# Altium schematic sheet EEG_Schematic.SchDoc: Low-Cost EEG
size A2; DrawnBy: Xavier Asghar; Revision: 1.0; SheetNumber: 1; SheetTotal: 1
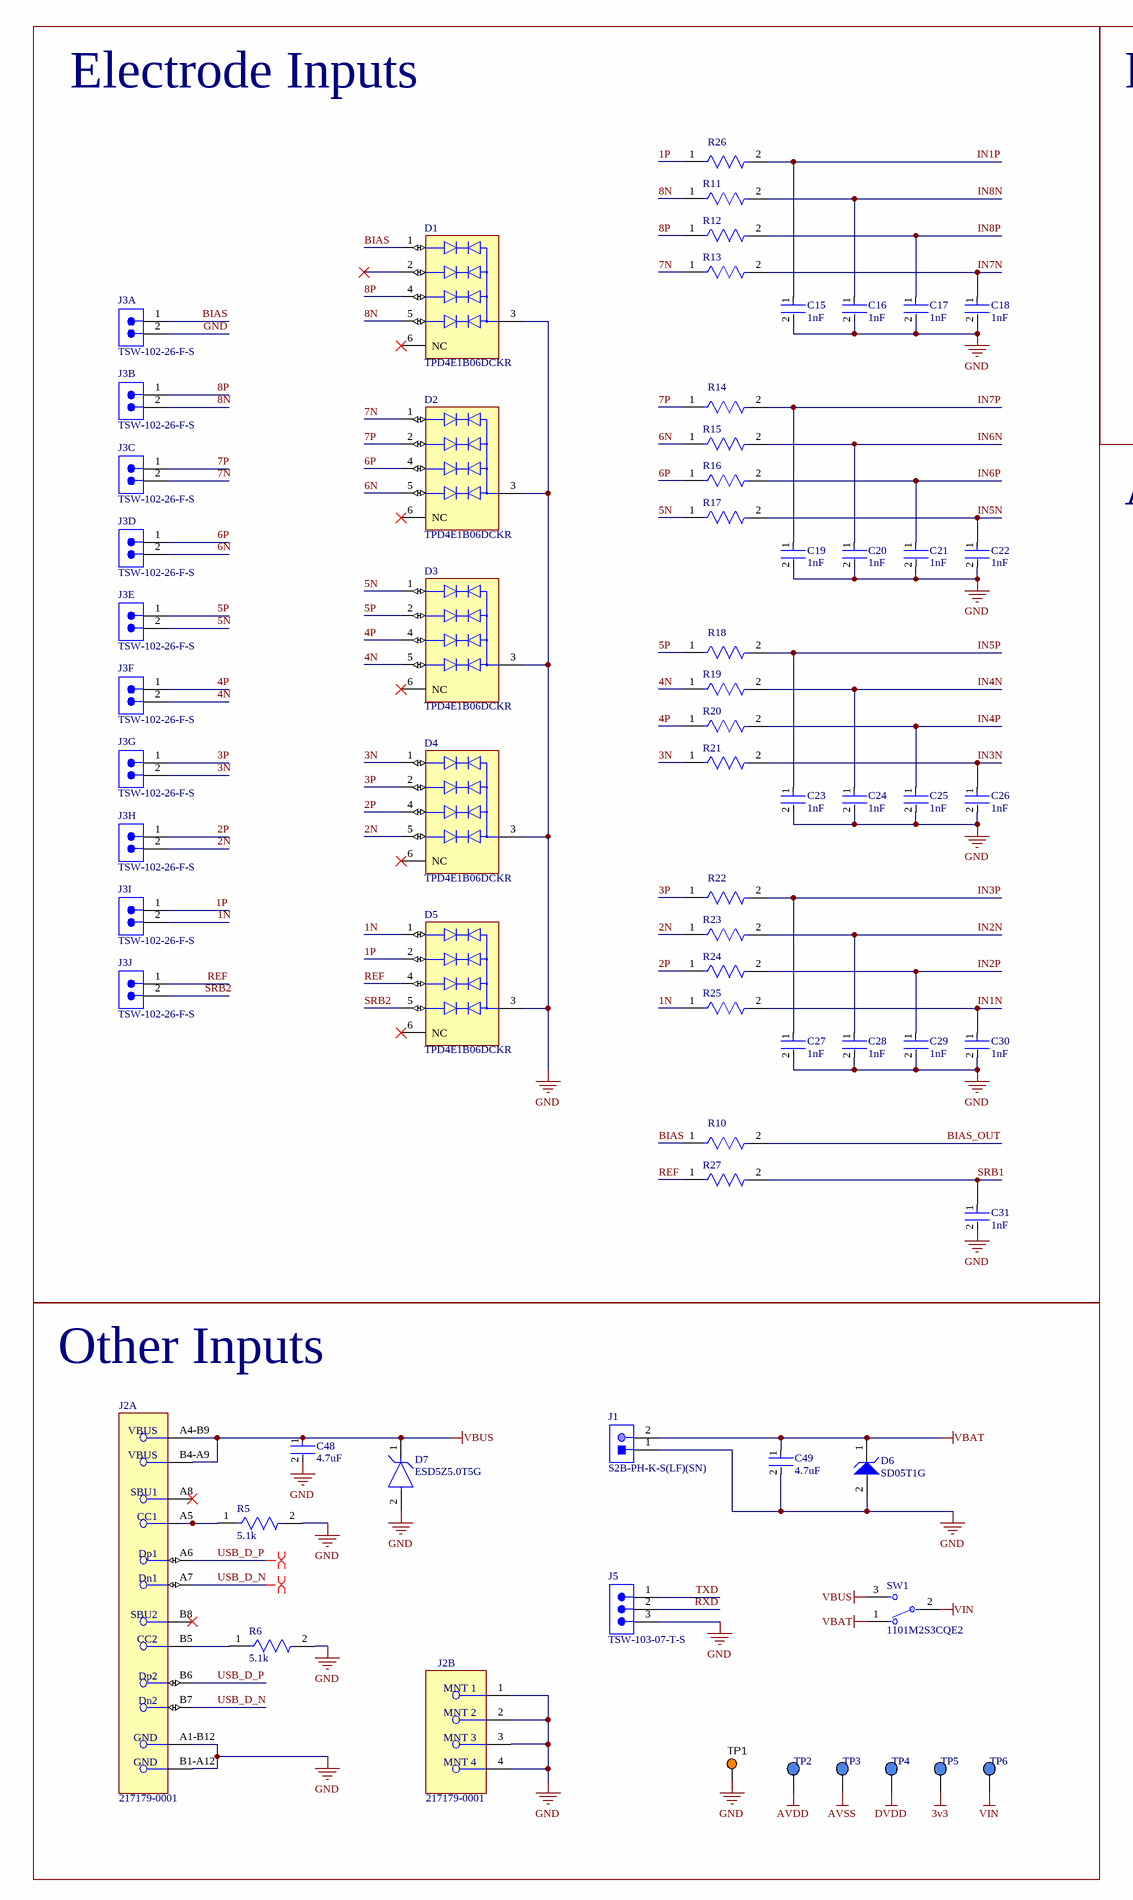
[diagram p0: EEG_Schematic.SchDoc, left]
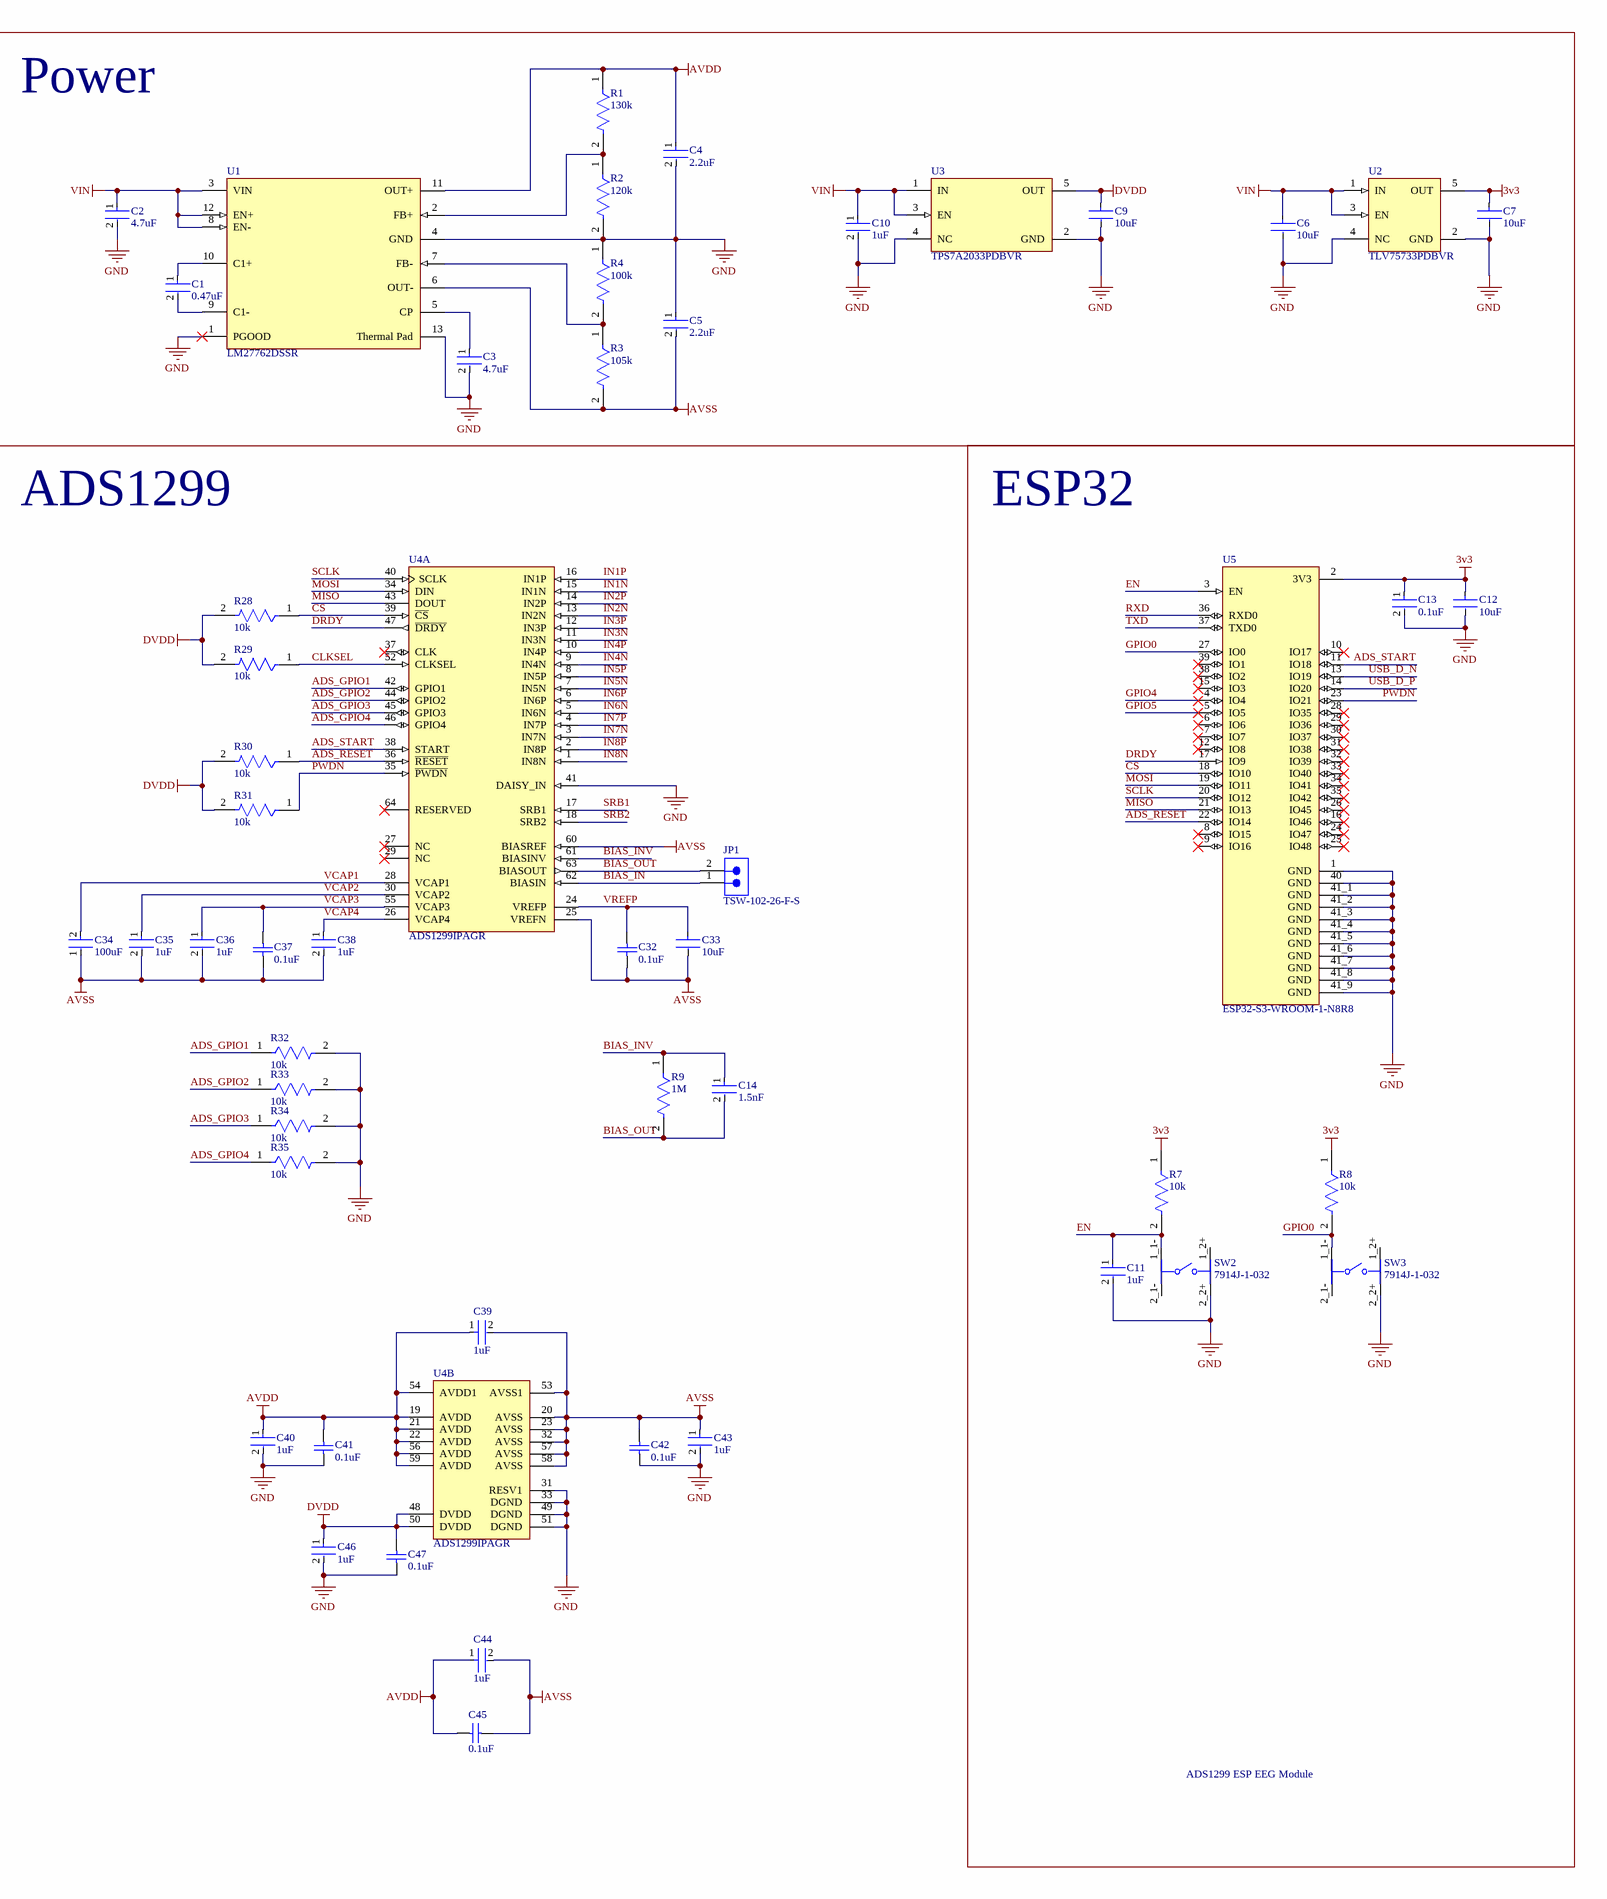
[diagram p1: EEG_Schematic.SchDoc, right]

## Parts
C1  0.47uF  [FP-C0603C-CF-MFG]
C2  4.7uF  [FP-GCJ21B-0_3-IPC_A]
C3  4.7uF  [FP-GCJ21B-0_3-IPC_A]
C4  2.2uF  [FP-GCM21B-0_15-IPC_B]
C5  2.2uF  [FP-GCM21B-0_15-IPC_B]
C6  10uF  [FP-GRJ21B-0_3-0_2-MFG]
C7  10uF  [FP-GRJ21B-0_3-0_2-MFG]
C9  10uF  [FP-GRJ21B-0_3-0_2-MFG]
C10  1uF  [FP-CC0603-DA-MFG]
C11  1uF  [FP-CC0603-DA-MFG]
C12  10uF  [FP-GRJ21B-0_3-0_2-MFG]
C13  0.1uF  [FP-CGA3E-0_3-0_1-MFG]
C14  1.5nF  [FP-C0603C-CF-MFG]
C15  1nF  [FP-C0603C-CF-MFG]
C16  1nF  [FP-C0603C-CF-MFG]
C17  1nF  [FP-C0603C-CF-MFG]
C18  1nF  [FP-C0603C-CF-MFG]
C19  1nF  [FP-C0603C-CF-MFG]
C20  1nF  [FP-C0603C-CF-MFG]
C21  1nF  [FP-C0603C-CF-MFG]
C22  1nF  [FP-C0603C-CF-MFG]
C23  1nF  [FP-C0603C-CF-MFG]
C24  1nF  [FP-C0603C-CF-MFG]
C25  1nF  [FP-C0603C-CF-MFG]
C26  1nF  [FP-C0603C-CF-MFG]
C27  1nF  [FP-C0603C-CF-MFG]
C28  1nF  [FP-C0603C-CF-MFG]
C29  1nF  [FP-C0603C-CF-MFG]
C30  1nF  [FP-C0603C-CF-MFG]
C31  1nF  [FP-C0603C-CF-MFG]
C32  0.1uF  [CAPC1608X87X45LL20T05]
C33  10uF  [FP-GRJ21B-0_3-0_2-MFG]
C34  100uF  [FP-GRM31C-0_3-e0_3_0_8-IPC_B]
C35  1uF  [FP-CC0603-DA-MFG]
C36  1uF  [FP-CC0603-DA-MFG]
C37  0.1uF  [CAPC1608X87X45LL20T05]
C38  1uF  [FP-CC0603-DA-MFG]
C39  1uF  [FP-CC0603-DA-MFG]
C40  1uF  [FP-CC0603-DA-MFG]
C41  0.1uF  [CAPC1608X87X45LL20T05]
C42  0.1uF  [CAPC1608X87X45LL20T05]
C43  1uF  [FP-CC0603-DA-MFG]
C44  1uF  [FP-CC0603-DA-MFG]
C45  0.1uF  [CAPC1608X87X45LL20T05]
C46  1uF  [FP-CC0603-DA-MFG]
C47  0.1uF  [CAPC1608X87X45LL20T05]
C48  4.7uF  [FP-GCJ21B-0_3-IPC_A]
C49  4.7uF  [FP-GCJ21B-0_3-IPC_A]
D1  TPD4E1B06DCKR  [TVS_TPD4E1B06DCKR]
D2  TPD4E1B06DCKR  [TVS_TPD4E1B06DCKR]
D3  TPD4E1B06DCKR  [TVS_TPD4E1B06DCKR]
D4  TPD4E1B06DCKR  [TVS_TPD4E1B06DCKR]
D5  TPD4E1B06DCKR  [TVS_TPD4E1B06DCKR]
D6  SD05T1G  [ONSC-SOD-323-2-477-02_G_V]
D7  ESD5Z5.0T5G  [FP-502-01-MFG]
J1  S2B-PH-K-S(LF)(SN)  [JST-S2B-PH-K-S_V]
J2  217179-0001  [FP-2171790001-MFG]  (parts A,B of 2)
J3A  TSW-102-26-F-S  [SMTC-TSW-102-26-XX-S]
J3B  TSW-102-26-F-S  [SMTC-TSW-102-26-XX-S]
J3C  TSW-102-26-F-S  [SMTC-TSW-102-26-XX-S]
J3D  TSW-102-26-F-S  [SMTC-TSW-102-26-XX-S]
J3E  TSW-102-26-F-S  [SMTC-TSW-102-26-XX-S]
J3F  TSW-102-26-F-S  [SMTC-TSW-102-26-XX-S]
J3G  TSW-102-26-F-S  [SMTC-TSW-102-26-XX-S]
J3H  TSW-102-26-F-S  [SMTC-TSW-102-26-XX-S]
J3I  TSW-102-26-F-S  [SMTC-TSW-102-26-XX-S]
J3J  TSW-102-26-F-S  [SMTC-TSW-102-26-XX-S]
J5  TSW-103-07-T-S  [SMTC-TSW-103-07-X-S]
JP1  TSW-102-26-F-S  [SMTC-TSW-102-26-XX-S]
R1  130k  [FP-MCT0603-IPC_B]
R2  120k  [FP-RT0603-MFG]
R3  105k  [FP-RT0603-MFG]
R4  100k  [FP-AT0603-IPC_A]
R5  5.1k  [FP-RT0603-MFG]
R6  5.1k  [FP-RT0603-MFG]
R7  10k  [FP-AC0603-MFG]
R8  10k  [FP-AC0603-MFG]
R9  1M  [FP-MCT0603-MFG]
R10  2.2k  [FP-MCT0603-IPC_A]  (value not drawn)
R11  2.2k  [FP-MCT0603-IPC_A]  (value not drawn)
R12  2.2k  [FP-MCT0603-IPC_A]  (value not drawn)
R13  2.2k  [FP-MCT0603-IPC_A]  (value not drawn)
R14  2.2k  [FP-MCT0603-IPC_A]  (value not drawn)
R15  2.2k  [FP-MCT0603-IPC_A]  (value not drawn)
R16  2.2k  [FP-MCT0603-IPC_A]  (value not drawn)
R17  2.2k  [FP-MCT0603-IPC_A]  (value not drawn)
R18  2.2k  [FP-MCT0603-IPC_A]  (value not drawn)
R19  2.2k  [FP-MCT0603-IPC_A]  (value not drawn)
R20  2.2k  [FP-MCT0603-IPC_A]  (value not drawn)
R21  2.2k  [FP-MCT0603-IPC_A]  (value not drawn)
R22  2.2k  [FP-MCT0603-IPC_A]  (value not drawn)
R23  2.2k  [FP-MCT0603-IPC_A]  (value not drawn)
R24  2.2k  [FP-MCT0603-IPC_A]  (value not drawn)
R25  2.2k  [FP-MCT0603-IPC_A]  (value not drawn)
R26  2.2k  [FP-MCT0603-IPC_A]  (value not drawn)
R27  2.2k  [FP-MCT0603-IPC_A]  (value not drawn)
R28  10k  [FP-AC0603-MFG]
R29  10k  [FP-AC0603-MFG]
R30  10k  [FP-AC0603-MFG]
R31  10k  [FP-AC0603-MFG]
R32  10k  [FP-AC0603-MFG]
R33  10k  [FP-AC0603-MFG]
R34  10k  [FP-AC0603-MFG]
R35  10k  [FP-AC0603-MFG]
SW1  1101M2S3CQE2  [FP-1101M2S3CQE2-MFG]
SW2  7914J-1-032  [FP-7914J-1-032-MFG]
SW3  7914J-1-032  [FP-7914J-1-032-MFG]
TP1  (no value)  [KSTN-5003]
TP2  TP  [TP_SMD_2mm]  (value not drawn)
TP3  TP  [TP_SMD_2mm]  (value not drawn)
TP4  TP  [TP_SMD_2mm]  (value not drawn)
TP5  TP  [TP_SMD_2mm]  (value not drawn)
TP6  TP  [TP_SMD_2mm]  (value not drawn)
U1  LM27762DSSR  [FP-DSS0012B-MFG]
U2  TLV75733PDBVR  [FP-DBV0005A-MFG]
U3  TPS7A2033PDBVR  [FP-DBV0005A-MFG]
U4  ADS1299IPAGR  [PAG0064A_M]  (parts A,B of 2)
U5  ESP32-S3-WROOM-1-N8R8  [XCVR_ESP32S3WROOM1N8R8]

## Blocks framed on the sheet
Electrode Inputs: C15-C31 D1-D5 J3A J3B J3C J3D J3E J3F J3G J3H J3I J3J R10-R27
Power: C1-C7 C9 C10 R1-R4 U1-U3
ESP32: C11-C13 R7 R8 SW2 SW3 U5
Other Inputs: C48 C49 D6 D7 J1 J2 J5 R5 R6 SW1 TP1-TP6

## Nets
3v3: C7.1 C12.1 C13.1 R7.1 R8.1 TP5.1(TP) U2.5(OUT) U5.2(3V3)
AVDD: C4.1 C39.1 C40.1 C41.2 C44.1 C45.2 R1.1 TP2.1(TP) U1.11(OUT+) U4.19(AVDD) U4.21(AVDD) U4.22(AVDD) U4.54(AVDD1) U4.56(AVDD) U4.59(AVDD)
AVSS: C5.2 C32.1 C33.2 C34.1 C35.2 C36.2 C37.1 C38.2 C39.2 C42.2 C43.1 C44.2 C45.1 R3.2 TP3.1(TP) U1.6(OUT-) U4.20(AVSS) U4.23(AVSS) U4.25(VREFN) U4.32(AVSS) U4.53(AVSS1) U4.57(AVSS) U4.58(AVSS) U4.60(BIASREF)
DVDD: C9.1 C46.1 C47.2 R28.2 R29.2 R30.2 R31.2 TP4.1(TP) U3.5(OUT) U4.48(DVDD) U4.50(DVDD)
GND: C2.2 C3.2 C4.2 C5.1 C6.2 C7.2 C9.2 C10.2 C11.2 C12.2 C13.2 C15.2 C16.2 C17.2 C18.2 C19.2 C20.2 C21.2 C22.2 C23.2 C24.2 C25.2 C26.2 C27.2 C28.2 C29.2 C30.2 C31.2 C40.2 C41.1 C42.1 C43.2 C46.2 C47.1 C48.2 C49.2 D1.3(GND) D2.3(GND) D3.3(GND) D4.3(GND) D5.3(GND) D6.2(A) D7.2(A) J1.1 J2.1(MNT_1) J2.2(MNT_2) J2.3(MNT_3) J2.4(MNT_4) J2.A1-B12(GND) J2.B1-A12(GND) J3A.2 J5.3 R2.2 R4.1 R5.2 R6.2 R32.2 R33.2 R34.2 R35.2 SW2.2_2+(2_2+) SW3.2_2+(2_2+) TP1.1 U1.1(PGOOD) U1.4(GND) U1.13(Thermal_Pad) U2.2(GND) U2.4(NC) U3.2(GND) U3.4(NC) U4.31(RESV1) U4.33(DGND) U4.41(DAISY_IN) U4.49(DGND) U4.51(DGND) U5.1(GND) U5.40(GND) U5.41_1(GND) U5.41_2(GND) U5.41_3(GND) U5.41_4(GND) U5.41_5(GND) U5.41_6(GND) U5.41_7(GND) U5.41_8(GND) U5.41_9(GND)
VBAT: C49.1 D6.1(K) J1.2 SW1.1
VBUS: C48.1 D7.1(C) J2.A4-B9(VBUS) J2.B4-A9(VBUS) SW1.3
VIN: C2.1 C6.1 C10.1 SW1.2(COMM) TP6.1(TP) U1.3(VIN) U1.8(EN-) U1.12(EN+) U2.1(IN) U2.3(EN) U3.1(IN) U3.3(EN)
1N: D5.1(IO1) J3I.2 R25.1
1P: D5.2(IO2) J3I.1 R26.1
2N: D4.5(IO4) J3H.2 R23.1
2P: D4.4(IO3) J3H.1 R24.1
3N: D4.1(IO1) J3G.2 R21.1
3P: D4.2(IO2) J3G.1 R22.1
4N: D3.5(IO4) J3F.2 R19.1
4P: D3.4(IO3) J3F.1 R20.1
5N: D3.1(IO1) J3E.2 R17.1
5P: D3.2(IO2) J3E.1 R18.1
6N: D2.5(IO4) J3D.2 R15.1
6P: D2.4(IO3) J3D.1 R16.1
7N: D2.1(IO1) J3C.2 R13.1
7P: D2.2(IO2) J3C.1 R14.1
8N: D1.5(IO4) J3B.2 R11.1
8P: D1.4(IO3) J3B.1 R12.1
ADS_GPIO1: R32.1 U4.42(GPIO1)
ADS_GPIO2: R33.1 U4.44(GPIO2)
ADS_GPIO3: R34.1 U4.45(GPIO3)
ADS_GPIO4: R35.1 U4.46(GPIO4)
ADS_RESET: R30.1 U4.36(~{RESET}) U5.22(IO14)
ADS_START: U4.38(START) U5.11(IO18)
BIAS: D1.1(IO1) J3A.1 R10.1
BIAS_IN: JP1.1 U4.62(BIASIN)
BIAS_INV: C14.1 R9.1 U4.61(BIASINV)
BIAS_OUT: C14.2 JP1.2 R9.2 R10.2 U4.63(BIASOUT)
CLKSEL: R29.1 U4.52(CLKSEL)
CS: R28.1 U4.39(~{CS}) U5.18(IO10)
DRDY: U4.47(~{DRDY}) U5.17(IO9)
EN: C11.1 R7.2 SW2.1_1-(1_1-) U5.3(EN)
GPIO0: R8.2 SW3.1_1-(1_1-) U5.27(IO0)
GPIO4: U5.4(IO4)
GPIO5: U5.5(IO5)
IN1N: C30.1 R25.2 U4.15(IN1N)
IN1P: C15.1 R26.2 U4.16(IN1P)
IN2N: C28.1 R23.2 U4.13(IN2N)
IN2P: C29.1 R24.2 U4.14(IN2P)
IN3N: C26.1 R21.2 U4.11(IN3N)
IN3P: C27.1 R22.2 U4.12(IN3P)
IN4N: C24.1 R19.2 U4.9(IN4N)
IN4P: C25.1 R20.2 U4.10(IN4P)
IN5N: C22.1 R17.2 U4.7(IN5N)
IN5P: C23.1 R18.2 U4.8(IN5P)
IN6N: C20.1 R15.2 U4.5(IN6N)
IN6P: C21.1 R16.2 U4.6(IN6P)
IN7N: C18.1 R13.2 U4.3(IN7N)
IN7P: C19.1 R14.2 U4.4(IN7P)
IN8N: C16.1 R11.2 U4.1(IN8N)
IN8P: C17.1 R12.2 U4.2(IN8P)
MISO: U4.43(DOUT) U5.21(IO13)
MOSI: U4.34(DIN) U5.19(IO11)
PWDN: R31.1 U4.35(~{PWDN}) U5.23(IO21)
REF: D5.4(IO3) J3J.1 R27.1
RXD: J5.2 U5.36(RXD0)
SCLK: U4.40(SCLK) U5.20(IO12)
SRB1: C31.1 R27.2 U4.17(SRB1)
SRB2: D5.5(IO4) J3J.2 U4.18(SRB2)
TXD: J5.1 U5.37(TXD0)
USB_D_N: J2.A7(Dn1) J2.B7(Dn2) U5.13(IO19)
USB_D_P: J2.A6(Dp1) J2.B6(Dp2) U5.14(IO20)
VCAP1: C34.2 U4.28(VCAP1)
VCAP2: C35.1 U4.30(VCAP2)
VCAP3: C36.1 C37.2 U4.55(VCAP3)
VCAP4: C38.1 U4.26(VCAP4)
VREFP: C32.2 C33.1 U4.24(VREFP)
NetC1_1: C1.1 U1.10(C1+)
NetC1_2: C1.2 U1.9(C1-)
NetC3_1: C3.1 U1.5(CP)
NetJ2_A5: J2.A5(CC1) R5.1
NetJ2_B5: J2.B5(CC2) R6.1
NetR1_2: R1.2 R2.1 U1.2(FB+)
NetR3_1: R3.1 R4.2 U1.7(FB-)

Not connected (* = marked no-connect by the designer): D1 2(IO2)* 6(NC)*; D2 6(NC)*; D3 6(NC)*; D4 6(NC)*; D5 6(NC)*; J2 A8(SBU1)* B8(SBU2)*; SW2 1_2+(1_2+) 2_1-(2_1-); SW3 1_2+(1_2+) 2_1-(2_1-); U4 27(NC)* 29(NC)* 37(CLK)* 64(RESERVED)*; U5 6(IO6)* 7(IO7)* 8(IO15)* 9(IO16)* 10(IO17)* 12(IO8)* 15(IO3)* 16(IO46)* 24(IO47)* 25(IO48)* 26(IO45)* 28(IO35)* 29(IO36)* 30(IO37)* 31(IO38)* 32(IO39)* 33(IO40)* 34(IO41)* 35(IO42)* 38(IO2)* 39(IO1)*

## Layout directives
differential pair: USB_D_N, USB_D_P

## Notes on the sheet
- ADS1299
- ADS1299 ESP EEG Module

## Library data of the parts
C1 = CMP-03020-032491-1: Cap Ceramic 0.47uF 16V X7R 10% Pad SMD 0603 125C Automotive T/R; Manufacturer: KEMET; Manufacturer Part Number: C0603C474K4RACAUTO; Value: 0.47 μF; Tolerance: 0.1; Automotive Grade: Grade 1; Temperature Coefficient: 30ppm/°C; ComponentLink2Description: Datasheet; Digikey Description: Cap Ceramic 0.47uF 16V X7R 10% Pad SMD 0603 125C Automotive T/R; Capacitance: 0.47 μF; Temperature Characteristic: X7R; ComponentLink2URL: https://api.kemet.com/component-edge/download/datasheet/C0603C100J5GACAUTO.pdf; Lead Free: Yes; Voltage Rating: 16 V; RoHS: TRUE; Material: Ceramic; Package: C0603C-CF; Temperature Range High: +125°C; Category: Cap; Device Class L3: Ceramic Capacitors; Temperature: -55°C to +125°C; Device Class L1: Passive Components; Automotive: Yes; Octopart: https://octopart.com/c0603c474k4racauto-kemet-25528703; Device Class L2: Capacitors; Temperature Range Low: -55°C; Height: 0.87mm
C2 C3 C48 C49 = CMP-06035-051513-1: Multilayer Ceramic Capacitors MLCC - SMD/SMT 0805 4.7uF 10%, 16VDC,  X7R 15%; Voltage Rating (DC): 16V; Case/Package: 0805; Tolerance: 10%; Package Quantity: 10000; Packaging: Tape and Reel; Case Code (Metric): 2012; Min Operating Temperature: -55°C; Termination: SMD/SMT; Capacitance: 4.7uF; Weight: 0.000335oz; Height: 1.25mm; Case Code (Imperial): 0805; Length: 2mm; Width: 1.25mm; Dielectric: X7R; Max Operating Temperature: 125°C
C4 C5 = CMP-06035-043857-1: Ceramic Capacitor for Automotive 2.2uF ±10% 16VDC X7R 0805 Embossed T/R; Voltage Rating (DC): 16V; Min Operating Temperature: -55°C; Dielectric: X7R; Packaging: Tape and Reel; Max Operating Temperature: 125°C; Length: 2mm; Width: 1.25mm; Tolerance: 10%; Radiation Hardening: No; Termination: SMD/SMT; Height: 1.25mm; Case/Package: 0805; Mount: Surface Mount; Package Quantity: 10000; Capacitance: 2.2uF; Voltage Rating: 16V; Case Code (Imperial): 0805; Depth: 1.25mm; Case Code (Metric): 2012
C6 C7 C9 C12 C33 = CMP-06035-062264-1: CAP CER MLCC; RoHS Compliant: Yes
C10 C11 C35 C36 C38-C40 C43 C44 C46 = CMP-03422-000924-1: CAP CER 1UF 16V X7R 0603; Manufacturer: YAGEO; Manufacturer Part Number: CC0603KRX7R7BB105; Tolerance: 0.1; Temperature Coefficient: 15%; Material: Ceramic; Package: CC0603-DA; RoHS: TRUE; Device Class L2: Capacitors; Temperature Characteristic: X7R; Temperature: -55°C to +125°C; Temperature Range Low: -55°C; Automotive: No; ComponentLink2Description: Datasheet; Value: 1 uF; Lead Free: Yes; Capacitance: 1 uF; ComponentLink2URL: http://www.yageo.com/documents/recent/UPY-GPHC_X7R_6.3V-to-50V_18.pdf; Device Class L1: Passive Components; Voltage: 16 V; Octopart: https://octopart.com/cc0603krx7r7bb105-yageo-42271928; Category: Cap; Digikey Description: CAP CER 1UF 16V X7R 0603; Footprint Url: http://www.yageo.com/exep/pages/download/literatures/UPY-C_GEN_24.pdf; Height: 0.9mm; Voltage Rating: 16 V; Temperature Range High: +125°C; Mouser Description: Multilayer Ceramic Capacitor, CC Series, 1 - F, - 10%, X7R, 16 V, 0603 [1608 Metric]; Device Class L3: Ceramic Capacitors
C13 = CMP-08246-001259-1: Cap Ceramic 100nF 50V X7R 10% Pad SMD 0603 +125°C Automotive T/R; Weight: 7.1E-05oz; Case Code (Imperial): 0603; Min Operating Temperature: -55°C; Packaging: Tape and Reel; Dielectric: X7R; Tolerance: 10%; Case Code (Metric): 1608; Max Operating Temperature: 125°C; Composition: Ceramic; Capacitance: 100nF; Termination: SMD/SMT; Length: 1.6mm; Height: 0.8mm; Case/Package: 0603; Thickness: 0.035inch; Mount: Surface Mount; Voltage Rating (DC): 50V; Width: 0.8mm; Ratings: AEC-Q200; Voltage Rating: 50V; Depth: 0.8mm; Package Quantity: 4000
C14 = CMP-1035-01967-3: CAP CER 1500PF 100V NP0 0603; Manufacturer Part Number: C0603C152J1GACTU; Manufacturer: KEMET; Capacitance: 1,500 pF; Material: Ceramic; Automotive Grade: Grade 1; Temperature Characteristic: C0G; Value: 1,500 pF; Tolerance: 0.05; Temperature Coefficient: 30ppm/°C; ComponentLink2URL: https://api.kemet.com/component-edge/download/datasheet/C0603C100J5GACAUTO.pdf; ComponentLink2Description: Datasheet; Package: C0603C-CF; Octopart: https://octopart.com/c0603c152j1gactu-kemet-12793172; Lead Free: Yes; Temperature Range Low: -55°C; Digikey Description: CAP CER 1500PF 100V NP0 0603; Height: 0.87mm; Device Class L1: Passive Components; Mouser Description: Cap Ceramic 0.0015uF 100V C0G 5% SMD 0603 125°C Paper T/R; Voltage Rating: 100 V; Device Class L2: Capacitors; Category: Cap; Device Class L3: Ceramic Capacitors; Automotive: Yes; Temperature: -55°C to +125°C; Temperature Range High: +125°C; RoHS: TRUE
C15-C31 = CMP-2006-03365-2: CAP CER 1000PF 50V 1% NP0 0603; Manufacturer Part Number: C0603C102F5GACTU; Manufacturer: KEMET; Value: 1,000 pF; Temperature Characteristic: C0G; Temperature Coefficient: 30ppm/°C; Tolerance: 0.01; Automotive Grade: Grade 1; Material: Ceramic; Device Class L3: Ceramic Capacitors; ComponentLink2Description: Datasheet; Category: Cap; Height: 0.87mm; Digikey Description: CAP CER 1000PF 50V 1% NP0 0603; Temperature: -55°C to +125°C; Lead Free: Yes; Temperature Range Low: -55°C; Mouser Description: Cap Ceramic 0.001uF 50V C0G 1% SMD 0603 125°C Paper T/R; ComponentLink2URL: https://api.kemet.com/component-edge/download/datasheet/C0603C100J5GACAUTO.pdf; Capacitance: 1,000 pF; Package: C0603C-CF; Device Class L2: Capacitors; Voltage Rating: 50 V; RoHS: TRUE; Automotive: Yes; Octopart: https://octopart.com/c0603c102f5gactu-kemet-9139790; Temperature Range High: +125°C; Device Class L1: Passive Components
C32 C37 C41 C42 C45 C47 = CMP-2006-00001-1: Part Number: C0603X104J4RACTU; Manufacturer: Kemet
C34 = CMP-06035-033997-1: Chip Multilayer Ceramic Capacitors for General Purpose, 1206, 100uF, X5R, 15%, 20%, 10V
D1-D5 = TPD4E1B06DCKR: Quad 0.7-pF, Â±5.5-V, Â±12-kV ESD protection diode with 0.5-nA max leakage in SOT & SC70 packages; MF: Texas Instruments; SnapEDA_Link: https://www.snapeda.com/parts/TPD4E1B06DCKR/Texas+Instruments/view-part/?ref=snap; Package: SOT-SC70-6 Texas Instruments; Value: *; MP: TPD4E1B06DCKR; Check_prices: https://www.snapeda.com/parts/TPD4E1B06DCKR/Texas+Instruments/view-part/?ref=eda
D6 = CMP-1061-00629-1: Transient Voltage Suppressor Diode, for ESD Protection, 2-Pin SOD-323, Pb-Free, Tape and Reel; Manufacturer: On Semiconductor; PPK Max (W): 350; IR Max (uA): 10; Direction: Unidirectional; ComponentLink1Description: Manufacturer URL; PackageReference: SOD-323-2-477-02_G; Mounting Technology: Surface Mount; PackageVersion: Rev. G, 02/2005; ComponentLink2URL: http://www.onsemi.com/pub_link/Collateral/SD05T1-D.PDF; PackageDescription: 2-Pin SOD, Body 1.7 x 1.25 mm; Packing: Tape and Reel; ComponentLink2Description: Datasheet; ComponentLink1URL: http://www.onsemi.com/; ComponentLink3Description: Package Specification; ComponentLink3URL: http://www.onsemi.com/pub_link/Collateral/SD05T1-D.PDF; PartNumber: SD05T1G; RoHS: Pb-Free; DatasheetVersion: Rev. 2
D7 = CMP-00278-54317238-1: ESD5Z5.0T5G Trans Voltage Suppressor Diode, 174W, 5V V(RWM), Unidirectional, 1 Element, Silicon; Manufacturer Lifecycle Status: ACTIVE; Breakdown Voltage: 6.2V; Number of Channels: 1; Max Junction Temperature (Tj): 150°C; Max Power Dissipation: 500mW; Clamping Voltage: 18.6V; Power Line Protection: No; Capacitance: 80pF; Peak Pulse Current: 9.4A; Lifecycle Status: Production; Composition: Zener; Height: 700µm; Packaging: Tape & Reel (TR); NexarPartId: 54317238; Number of Unidirectional Channels: 1; Peak Pulse Power: 174W; Max Operating Temperature: 150°C; RoHS: Compliant; Mount: Surface Mount; Lead Free: Lead Free; Min Operating Temperature: -55°C; Reverse Standoff Voltage: 5V; Min Breakdown Voltage: 6.2V; Direction: Unidirectional
J1 = CMP-1755-00004-1: Male Header, Pitch 2 mm, 1 x 2 Position, Height 4.8 mm, Tail Length 3.4 mm, -25 to 85 degC, RoHS, Bulk; Case\Package: Radial; Tolerance: 20%; Capacitance: 10 uF; Voltage Rating (DC): 50 V; Packaging: Bulk; ComponentLink1URL: http://www.jst-mfg.com/product/pdf/eng/ePH.pdf; Radiation Hardening: No; Height: 11 mm; Package Quantity: 200; PackageDescription: Male Header, Pitch 2 mm, 1 x 2 Position, Height 4.8 mm, Tail Length 3.4 mm; PackageReference: S2B-PH-K-S; Diameter: 5 mm; Pins: 2; Mount: Through Hole; Max Operating Temperature: 85 degC; Min Operating Temperature: -40 degC; ComponentLink1Description: Datasheet; DatasheetVersion: Dec-12; Length: 11 mm; Lead Pitch: 2 mm; REACH SVHC: No SVHC; Voltage Rating: 50 V; RoHSCompliant: true
J2 = CMP-04767-000028-2: CONN RCP USB2.0 TYP C 24P SMD RA; NexarPartId: 117190526; Gender: Receptacle; Number of Contacts: 16; Current Rating: 1.25A; Voltage Rating: 30V; Min Operating Temperature: -40°C; USB Standard: USB 2.0; Height: 3.36mm; Contact Material: Gold, Nickel; Max Operating Temperature: 85°C
J3A J3B J3C J3D J3E J3F J3G J3H J3I J3J JP1 = CMP-1024-00329-1: 0.025" SQ Post Header, Through-hole, Vertical, -55 to 125 degC, 2.54 mm Pitch, 2-Pin, Male, RoHS; Manufacturer: Samtec; Pitch: 2.54 mm; PackageVersion: DM, 8/1988; ComponentLink2Description: Datasheet; PackageReference: TSW-102-26-XX-S; ComponentLink3URL: http://www.samtec.com/documents/webfiles/cpdf/TSW-XXX-XX-XXX-X-XX-XXX-MKT.pdf; ComponentLink2URL: http://www.samtec.com/documents/webfiles/pdf/TSW_TH.PDF; ComponentLink1Description: Manufacturer URL; DatasheetVersion: F-214; RoHS: True; ComponentLink3Description: Package Specification; PartNumber: TSW-102-26-F-S; Temperature Range: -55 to 125 degC; Orientation: Vertical; ComponentLink1URL: http://www.samtec.com; PackageDescription: .025[0.64] SQ. Post Terminal Strip Assembly; Mounting Technology: Through-hole
J5 = CMP-1024-00332-1: 0.025" SQ Post Header, Through-hole, Vertical, -55 to 105 degC, 2.54 mm Pitch, 3-Pin, Male, RoHS; Manufacturer: Samtec; Pitch: 2.54 mm; ComponentLink1URL: http://www.samtec.com; ComponentLink3URL: http://www.samtec.com/documents/webfiles/cpdf/TSW-XXX-XX-XXX-X-XX-XXX-MKT.pdf; PartNumber: TSW-103-07-T-S; Mounting Technology: Through-hole; RoHS: True; DatasheetVersion: F-214; PackageVersion: DM, 8/1988; Temperature Range: -55 to 105 degC; ComponentLink2Description: Datasheet; ComponentLink1Description: Manufacturer URL; Orientation: Vertical; PackageReference: TSW-103-07-X-S; ComponentLink3Description: Package Specification; ComponentLink2URL: http://www.samtec.com/documents/webfiles/pdf/TSW_TH.PDF; PackageDescription: .025[0.64] SQ. Post Terminal Strip Assembly
R1 = CMP-02407-000546-1: RES SMD 100 OHM 1% 1/8W 0603; Voltage Rating (DC): 50V; Tolerance: 0.1%; Resistance: 130kR; Max Power Dissipation: 100mW; Temperature Coefficient: 25ppm/°C; Case/Package: 0603; Number of Terminations: 2; Max Operating Temperature: 125°C; Military Standard: Not; Package Quantity: 1000; Depth: 0.85mm; Lead Free: Lead Free; Radiation Hardening: No; Height: 0.022inch; Packaging: Tape and Reel; Contact Plating: Tin; Width: 0.033inch; Composition: Thin Film; Min Operating Temperature: -55°C; Length: 0.061inch
R2 = CMP-2000-04351-2: RES SMD 120K OHM 0.1% 1/10W 0603; Manufacturer: Yageo; Manufacturer Part Number: RT0603BRD07120KL; Tolerance: 0.001; Voltage Rating: 75V; Resistance: 120KΩ; Temperature Coefficient: 25 ppm/°C; Value: 120KΩ; Power Rating: 0.1W; Lead Free: Yes; Automotive: No; Device Class L2: Resistors; RoHS: TRUE; Height: 0.55mm; ComponentLink2Description: Datasheet; Device Class L3: Chip SMD Resistors; Package: RT0603; Temperature Range High: +155°C; ComponentLink2URL: http://www.yageo.com/documents/recent/PYu-RT_1-to-0.01_RoHS_L_9.pdf; Footprint Url: http://www.yageo.com/exep/pages/download/literatures/PYu-R_Mount_10.pdf; Octopart: https://octopart.com/rt0603brd07120kl-yageo-1373701; Category: Res; Temperature: -55°C to +155°C; Ipc Land Pattern Name: RESC16080X45; Device Class L1: Passive Components; Mouser Description: Thin Film Resistors - SMD 1/10W 120K ohm .1% 25ppm; Series: RT; Temperature Range Low: -55°C; Composition: Thin Film; Digikey Description: RES SMD 120K OHM 0.1% 1/10W 0603
R3 = CMP-03412-002786-1: RES SMD 105K OHM 0.1% 1/10W 0603; Manufacturer Part Number: RT0603BRD07105KL; Manufacturer: Yageo; Resistance: 105KΩ; Power Rating: 0.1W; Temperature Coefficient: 25 ppm/°C; Voltage Rating: 75V; Value: 105KΩ; Tolerance: 0.001; ComponentLink2Description: Datasheet; Mouser Description: Thin Film Resistors 1/10W 105K ohm .1% 25ppm; Composition: Thin Film; Temperature Range High: +155°C; Temperature Range Low: -55°C; ComponentLink2URL: http://www.yageo.com/documents/recent/PYu-RT_1-to-0.01_RoHS_L_9.pdf; Digikey Description: RES SMD 105K OHM 0.1% 1/10W 0603; Lead Free: Yes; Height: 0.55mm; Footprint Url: http://www.yageo.com/exep/pages/download/literatures/PYu-R_Mount_10.pdf; Device Class L1: Passive Components; Automotive: No; Octopart: https://octopart.com/rt0603brd07105kl-yageo-1216175; RoHS: TRUE; Package: RT0603; Temperature: -55°C to +155°C; Ipc Land Pattern Name: RESC16080X45; Device Class L3: Chip SMD Resistors; Series: RT; Category: Res; Device Class L2: Resistors
R4 = CMP-03412-009298-2: Thin Film Chip Resistors Automotive Grade 100kΩ 0.1% 25ppm/°C 0603; Max Power Dissipation: 100mW; Resistance: 100kR; Width: 0.032inch; Case/Package: 0603; Number of Terminations: 2; Length: 0.063inch; Temperature Coefficient: 25ppm/°C; Packaging: Cut Tape; RoHS Compliant: Yes; Ratings: AEC-Q200; Max Operating Temperature: 155°C; Resistor Type: Thin Film; Tolerance: 0.1%; Case Code (Imperial): 0603; Features: Moisture Resistant; Min Operating Temperature: -55°C; Height: 0.022inch; Series: AT; Case Code (Metric): 1608
R5 R6 = CMP-2000-04778-2: RES SMD 5.1K OHM 1% 1/10W 0603; Manufacturer: Yageo; Manufacturer Part Number: RT0603FRE075K1L; Value: 5.1KΩ; Temperature Coefficient: 50 ppm/°C; Power Rating: 0.1W; Voltage Rating: 75V; Tolerance: 0.01; Lead Free: Yes; Temperature Range High: +155°C; Package: RT0603; Resistance: 5.1KΩ; Series: RT; Footprint Url: http://www.yageo.com/exep/pages/download/literatures/PYu-R_Mount_10.pdf; Ipc Land Pattern Name: RESC16080X45; Mouser Description: Res Thin Film 0603 5.1K Ohm 1% 0.1W(1/10W) ±50ppm/C Epoxy Pad SMD T/R; Octopart: https://octopart.com/rt0603fre075k1l-yageo-1421390; ComponentLink2URL: http://www.yageo.com/documents/recent/PYu-RT_1-to-0.01_RoHS_L_9.pdf; RoHS: TRUE; Device Class L3: Chip SMD Resistors; Digikey Description: RES SMD 5.1K OHM 1% 1/10W 0603; Temperature: -55°C to +155°C; Height: 0.55mm; Automotive: No; Device Class L1: Passive Components; Temperature Range Low: -55°C; Category: Res; Composition: Thin Film; ComponentLink2Description: Datasheet; Device Class L2: Resistors
R7 R8 R28-R35 = CMP-03412-038553-1: RES 10kΩ 1.00% 0.2W 0603
R9 = CMP-02407-007592-1: RES SMD 100 OHM 1% 1/8W 0603; Resistance: 1MR; Military Standard: Not; Lead Free: Lead Free; Max Operating Temperature: 125°C; Tolerance: 1%; Min Operating Temperature: -55°C; Length: 1.55mm; Case/Package: 0603; Packaging: Tape and Reel; Composition: Thin Film; Depth: 0.85mm
R10-R27 = CMP-02407-000735-1: RES SMD 100 OHM 1% 1/8W 0603; Resistance: 2.2kR; Tolerance: 0.1%; Military Standard: Not; Width: 850um; Packaging: Tape and Reel; Composition: Thin Film; Min Operating Temperature: -55°C; Length: 1.55mm; Max Operating Temperature: 125°C; Depth: 0.85mm; Lead Free: Lead Free; Case/Package: 0603
SW1 = CMP-10038-000019-1: SWITCH SLIDE SPDT 6A 120V; Switch Travel: 2.16mm; Number of Positions: 3; Number of Poles: 1; Approvals: UL; Actuator Length: 5.08mm; Voltage Rating (DC): 28V; Max Voltage Rating (AC): 250V; Insulation Resistance: 1GR; Body Material: Stainless Steel; Actuator Type: Standard; Contact Resistance: 10mR; Switch Function: On-On; Actuator Material: Nylon; Actuator Color: Black; Electrical Life: 40000Cycles; Termination: PC Pins; Packaging: Bulk; Housing Material: Stainless Steel; Flammability Rating: UL94 V-0; Series: 1000; Contact Current Rating: 6A; Length: 12.7mm; Depth: 6.6mm; Orientation: Vertical; Max Current Rating: 6A; Max Operating Temperature: 65°C; Throw Configuration: SPDT; REACH SVHC: No SVHC; Contact Material: Copper; Max Voltage Rating (DC): 28V; Lead Free: Lead Free; Current Rating: 6A; Voltage Rating (AC): 120V; Contact Plating: Silver; Package Quantity: 1; Min Operating Temperature: -30°C; Mount: Through Hole
SW2 SW3 = CMP-07427-000007-1: SWITCH TACTILE SPST-NO 0.1A 16V; Mechanical Life: 100000Cycles; Switch Function: Off-Mom; Actuator Material: Rubber; Illumination Type: Non-Illuminated; Actuator Type: Standard; Operating Force: 300gf; Throw Configuration: SPST; Current Rating: 100mA; Contact Plating: Silver; Min Operating Temperature: -55°C; Series: 7914; Package Quantity: 50; Max Operating Temperature: 125°C; Depth: 5mm; Termination: J-Hook; Mount: Surface Mount; RoHS Compliant: Yes; Case/Package: SMD/SMT; Voltage Rating (DC): 16V; Orientation: Straight; Max Current Rating: 100mA; Packaging: Rail/Tube; Length: 5mm; Contact Material: Gold
TP1 = CMP-1672-00009-1: Test Point, Orange, 1-Pin THD, RoHS; Peak Reverse Current: 600 uA; Forward Current: 3 A; Max Surge Current: 80 A; Forward Voltage: 1.08 V; Max Operating Temperature: 150 degC; PackageReference: 5003; Pins: 2; ComponentLink2URL: http://keyelco.com/userAssets/file/M65p56.pdf; PackageDescription: 1-Pin Through Hole Device, Dia 2.54 mm; Weight: 0.01 lb; Diameter: 5.3 mm; Mount: Through Hole; Package Quantity: 500; Packaging: Bulk; Min Operating Temperature: -65 degC; ComponentLink1Description: Manufacturer URL; Height: 0.25 inch; ComponentLink1URL: http://www.keyelco.com/; ComponentLink2Description: Datasheet; Width: 0.25 inch; REACH SVHC: No SVHC; RoHSCompliant: true; Radiation Hardening: No; Length: 9.5 mm; DatasheetVersion: Jun-15
TP2-TP6 = TestPoint_SMD: 2mm diameter circular test point,
U1 = CMP-04918-000139-2: IC REG CHARGE PUMP ADJ DL 12WSON; Min Output Voltage: 1.5V; Max Input Voltage: 5.5V; Synchronous Rectifier: No; Output Type: Adjustable; Output Current: 250mA; Min Input Voltage: 2.7V; Quiescent Current: 390uA; Switching Frequency: 2.3MHz; Max Output Voltage: 5V; Topology: Charge Pump; Lead Free: Lead Free; Min Operating Temperature: -40°C; Max Operating Temperature: 85°C; RoHS Compliant: Yes; Packaging: Tape and Reel; Mount: Surface Mount
U2 = CMP-04917-000028-1: IC REG LINEAR 3.3V 1A SOT23-5; Manufacturer: Texas Instruments; Standoff Height: 0mm; Min Supply Voltage: 1.45V; Dropout Voltage: 1350mV; Output Type: Fixed; Max Junction Temp: +125°C; Max Supply Voltage: 5.5V; Number Of Outputs: 1; Accuracy Percentage: 1%; Manufacturer Part Number: TLV75733PDBVR; ComponentLink2Description: Datasheet; Temperature: -40°C to +125°C; RoHS: TRUE; ComponentLink2URL: http://www.ti.com/lit/ds/symlink/tlv757p.pdf; Output Voltage: 3.3V; Mouser Description: 1-A low-IQ small-size low-dropout (LDO) regulator 5-SOT-23 -40 to 125; Ipc Land Pattern Name: SOT95P280X145-5; Device Class L2: Power Management ICs; Package: DBV0005A; Height: 1.45mm; Category: IC; Digikey Description: IC REG LINEAR 3.3V 1A SOT23-5; Temperature Range High: +125°C; Octopart: https://octopart.com/tlv75733pdbvr-texas+instruments-91437073; Temperature Range Low: -40°C; Device Class L3: Voltage Regulators - Linear; Output Current: 1A; Device Class L1: Integrated Circuits (ICs); Automotive: No; Lead Free: Yes
U3 = CMP-04917-000300-1: IC REG LINEAR 3.3V 300MA SOT23-5; RoHS Compliant: Yes
U4 = CMP-0841-00001-2: Low-Noise, 8-Channel, 24-Bit Analog Front-End for Biopotential Measurement, 16 KSPS, -40 to 85 degC, 64-Pin PQFP (PAG-64), RoHS, Tape and Reel; Manufacturer: Texas Instruments; Architecture: Delta-Sigma; Interface: Serial SPI; # Input Channels: 8; Sample Rate (max) (KSPS): 16; Packing: PAG0064A; Reference Mode: Int, Ext; Resolution (Bits): 24; PackageReference: PAG-64; ComponentLink2Description: Datasheet; Operating Temperature Range (C): -40 to 85; ComponentLink1Description: Manufacturer URL; Mounting Technology: Surface Mount; ComponentLink3Description: Package Specification; PartNumber: ADS1299IPAGR; PackageDescription: 64-Pin Plastic Quad Flatpack, Body 10 x 10 mm, Pitch 0.5 mm; ComponentLink2URL: http://www.ti.com/lit/ds/symlink/ads1299.pdf; PackageVersion: 4040282/C; ComponentLink1URL: http://www.ti.com/; ComponentLink3URL: http://www.ti.com/lit/ml/mtqf006a/mtqf006a.pdf; RoHS: TRUE; DatasheetVersion: SBAS499A
U5 = ESP32-S3-WROOM-1-N8R8: Bluetooth, WiFi 802.11b/g/n, Bluetooth v5.0 Transceiver Module 2.4GHz PCB Trace Surface Mount; MF: Espressif Systems; Package: None; Price: None; Check_prices: https://www.snapeda.com/parts/ESP32-S3-WROOM-1-N8R8/Espressif+Systems/view-part/?ref=eda; Value: *; SnapEDA_Link: https://www.snapeda.com/parts/ESP32-S3-WROOM-1-N8R8/Espressif+Systems/view-part/?ref=snap; MP: ESP32-S3-WROOM-1-N8R8; Availability: In Stock; Purchase-URL: https://pricing.snapeda.com/search?q=ESP32-S3-WROOM-1-N8R8&ref=eda